# Altium schematic sheet Breeze2 Power V1.SchDoc
size A4
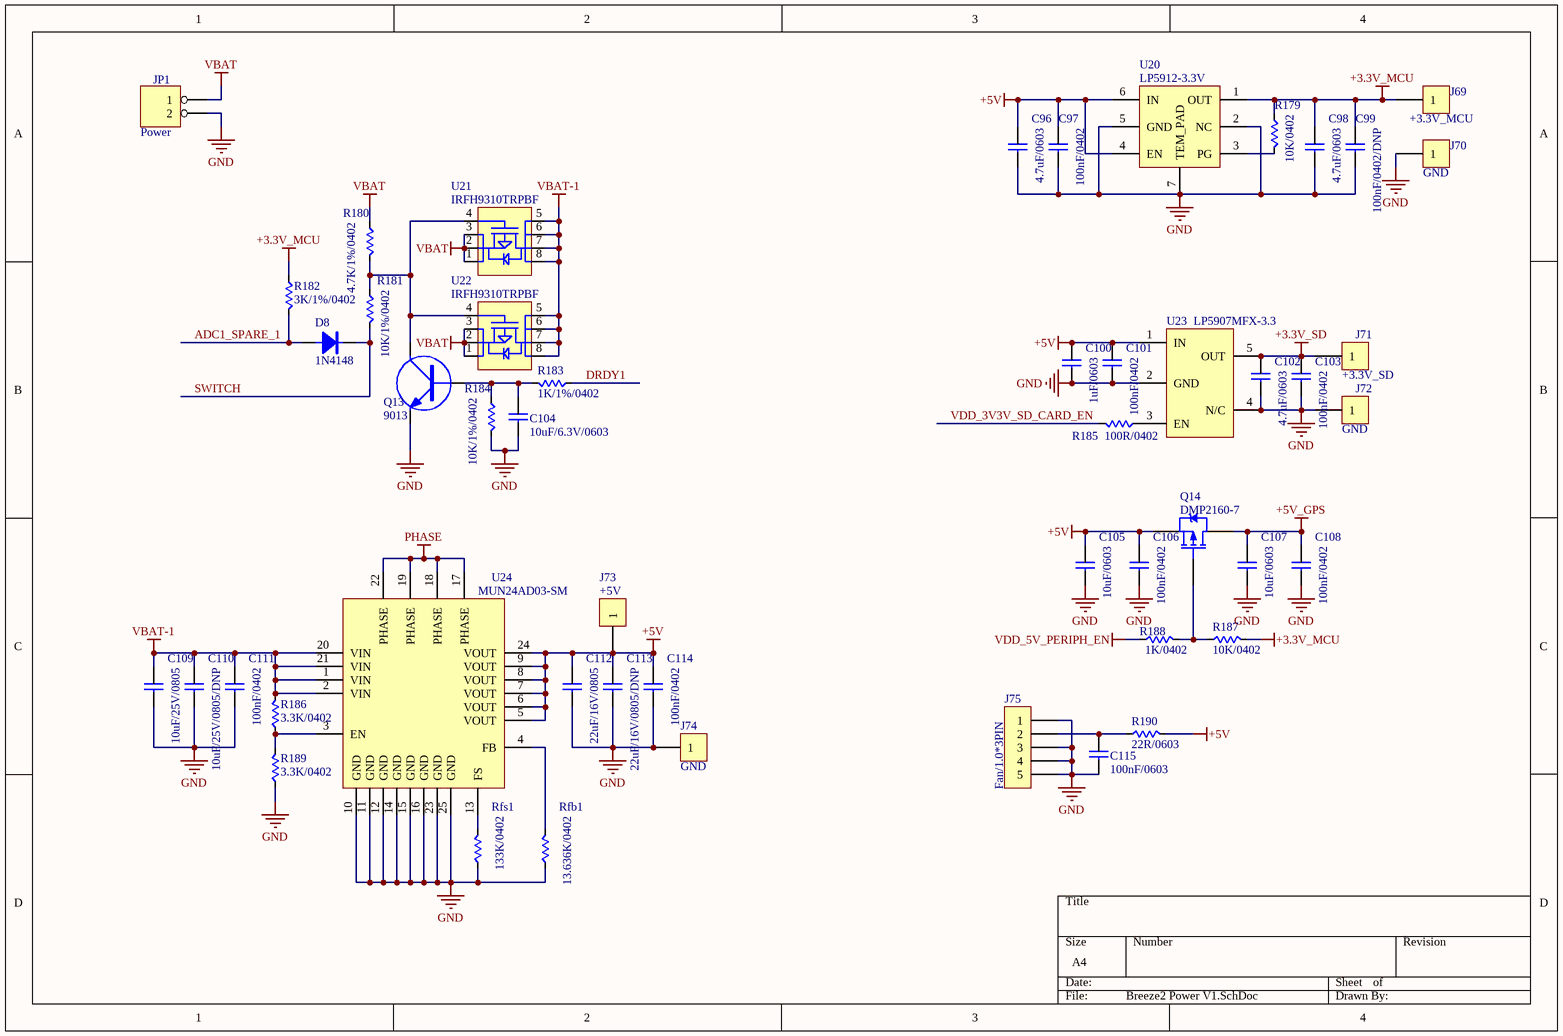
[diagram p0: Breeze2 Power V1.SchDoc]

## Parts
C96  4.7uF/0603  [0603C-S]
C97  100nF/0402  [0402C-S]
C98  4.7uF/0603  [0603C-S]
C99  100nF/0402/DNP  [0402C-S]
C100  1uF/0603  [0603C-S]
C101  100nF/0402  [0402C-S]
C102  4.7uF/0603  [0603C-S]
C103  100nF/0402  [0402C-S]
C104  10uF/6.3V/0603  [0603C-S]
C105  10uF/0603  [0603C-S]
C106  100nF/0402  [0402C-S]
C107  10uF/0603  [0603C-S]
C108  100nF/0402  [0402C-S]
C109  10uF/25V/0805  [0805C-S]
C110  10uF/25V/0805/DNP  [0805C-S]
C111  100nF/0402  [0402C-S]
C112  22uF/16V/0805  [0805C-S]
C113  22uF/16V/0805/DNP  [0805C-S]
C114  100nF/0402  [0402C-S]
C115  100nF/0603  [0603C-S]
D8  1N4148  [0603D]
J69  +3.3V_MCU  [TPJ1.0]
J70  GND  [TPJ1.0]
J71  +3.3V_SD  [TPJ1.0]
J72  GND  [TPJ1.0]
J73  +5V  [TPJ1.3]
J74  GND  [TPJ1.3]
J75  Fan/1.0*3PIN  [1.0*3PIN/SMD-H]
JP1  Power  [EC2]
Q13  9013  [SOT-23A]
Q14  DMP2160-7  [SOT-23A]
R179  10K/0402  [0402R-S]
R180  4.7K/1%/0402  [0402R-S]
R181  10K/1%/0402  [0402R-S]
R182  3K/1%/0402  [0402R-S]
R183  1K/1%/0402  [0402R-S]
R184  10K/1%/0402  [0402R-S]
R185  100R/0402  [0402R-S]
R186  3.3K/0402  [0402R-S]
R187  10K/0402  [0402R-S]
R188  1K/0402  [0402R-S]
R189  3.3K/0402  [0402R-S]
R190  22R/0603  [0603R-S]
Rfb1  13.636K/0402  [0402R-S]
Rfs1  133K/0402  [0402R-S]
U20  LP5912-3.3V  [S-PWSON-N6]
U21  IRFH9310TRPBF  [PQFN-8]
U22  IRFH9310TRPBF  [PQFN-8]
U23  LP5907MFX-3.3  [SOT-25A]
U24  MUN24AD03-SM  [MUN24AD03-SM]

## Nets
+3.3V_MCU: C98.1 C99.1 J69.1 R179.1 R182.1 R187.2 U20.1(OUT)
+3.3V_SD: C102.1 C103.1 J71.1 U23.5(OUT)
+5V: C96.1 C97.1 C100.1 C101.1 C105.1 C106.1 C112.1 C113.1 C114.1 J73.1 Q14.2(S) R190.2 U20.4(EN) U20.6(IN) U23.1(IN) U24.5(VOUT) U24.6(VOUT) U24.7(VOUT) U24.8(VOUT) U24.9(VOUT) U24.24(VOUT)
+5V_GPS: C107.1 C108.1 Q14.3(D)
GND: C96.2 C97.2 C98.2 C99.2 C100.2 C101.2 C102.2 C103.2 C104.2 C105.2 C106.2 C107.2 C108.2 C109.2 C110.2 C111.2 C112.2 C113.2 C114.2 C115.2 J70.1 J72.1 J74.1 J75.1 J75.3 J75.4 J75.5 JP1.2 Q13.2(E) R184.2 R189.1 Rfb1.1 Rfs1.1 U20.2(NC) U20.5(GND) U20.7(TEM_PAD) U23.2(GND) U23.4(N/C) U24.10(GND) U24.11(GND) U24.12(GND) U24.14(GND) U24.15(GND) U24.16(GND) U24.23(GND) U24.25(GND)
PHASE: U24.17(PHASE) U24.18(PHASE) U24.19(PHASE) U24.22(PHASE)
VBAT: JP1.1 R180.1 U21.1 U21.2 U21.3(SOURCE) U22.1 U22.2 U22.3(SOURCE)
VBAT-1: C109.1 C110.1 C111.1 R186.2 U21.5 U21.6 U21.7(DRAIN) U21.8 U22.5 U22.6 U22.7(DRAIN) U22.8 U24.1(VIN) U24.2(VIN) U24.20(VIN) U24.21(VIN)
VDD_5V_PERIPH_EN: R188.1
ADC1_SPARE_1: D8.1(A) R182.2
DRDY1: R183.1
SWITCH: D8.2(K) R181.2
VDD_3V3V_SD_CARD_EN: R185.2
NetC104_1: C104.1 Q13.1(B) R183.2 R184.1
NetC115_1: C115.1 J75.2 R190.1
NetQ13_3: Q13.3(C) R180.2 R181.1 U21.4(GATE) U22.4(GATE)
NetQ14_1: Q14.1(G) R187.1 R188.2
NetR179_2: R179.2 U20.3(PG)
NetR185_1: R185.1 U23.3(EN)
NetR186_1: R186.1 R189.2 U24.3(EN)
NetRfb1_2: Rfb1.2 U24.4(FB)
NetRfs1_2: Rfs1.2 U24.13(FS)

## Library data of the parts
C96-C115 = CAP
D8 = DIODE
J69-J74 = CON1: Connector
J75 = CON5: Connector
JP1 = HEADER 2
Q13 = NPN: NPN Transistor
Q14 = IRLML6302: HEXFET Power MOSFET
R179-R185 R187 R188 R190 = Res
R186 R189 Rfb1 Rfs1 = RES: Y02-00493
U21 U22 = MDU3603RH: TPCC8104
U23 = LP5907